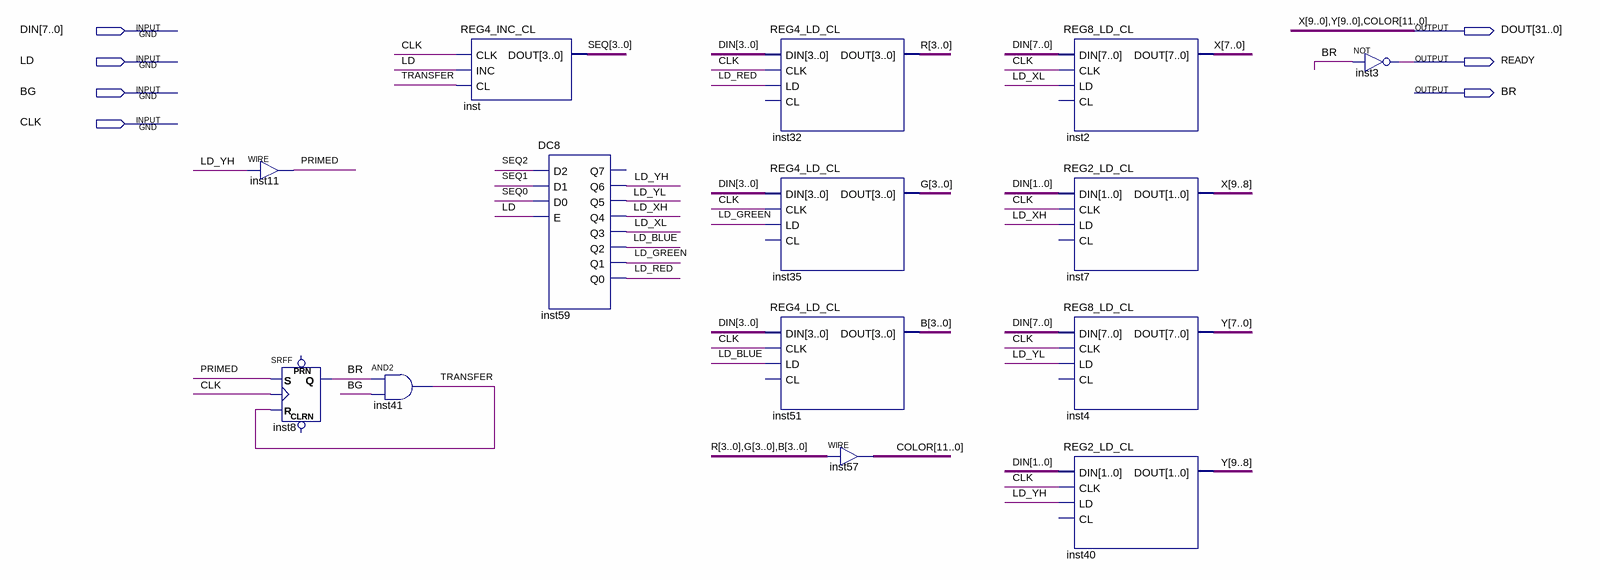
[diagram p0: schematic sheet]
// Quartus schematic render_pixel.bdf as structural Verilog: 14 symbols, 7 pins
module render_pixel (
  input  [7:0] DIN,
  input  LD,
  input  BG,
  input  CLK,
  output [31:0] DOUT,
  output READY,
  output BR
);

  wire LD_BLUE, LD_GREEN, LD_RED, LD_XH, LD_XL, LD_YH, LD_YL, PRIMED, TRANSFER;
  wire [3:0] B, G, R, SEQ;

  assign PRIMED = LD_YH;  // WIRE inst11
  SRFF inst8 (.S(PRIMED), .R(TRANSFER), .CLK(CLK), .Q(BR));  // open: PRN, CLRN
  and inst41 (TRANSFER, BR, BG);
  REG4_INC_CL inst (.CLK(CLK), .INC(LD), .CL(TRANSFER), .DOUT(SEQ));
  DC8 inst59 (
    .D2(SEQ[2]), .D1(SEQ[1]), .D0(SEQ[0]), .E(LD), .Q6(LD_YH), .Q5(LD_YL), .Q4(LD_XH), .Q3(LD_XL),
    .Q2(LD_BLUE), .Q1(LD_GREEN), .Q0(LD_RED));  // open: Q7
  REG4_LD_CL inst32 (.DIN(DIN[3:0]), .CLK(CLK), .LD(LD_RED), .DOUT(R));  // open: CL
  REG4_LD_CL inst35 (.DIN(DIN[3:0]), .CLK(CLK), .LD(LD_GREEN), .DOUT(G));  // open: CL
  REG4_LD_CL inst51 (.DIN(DIN[3:0]), .CLK(CLK), .LD(LD_BLUE), .DOUT(B));  // open: CL
  assign DOUT[11:0] = {R, G, B};  // WIRE inst57
  REG8_LD_CL inst2 (.DIN(DIN), .CLK(CLK), .LD(LD_XL), .DOUT(DOUT[29:22]));  // open: CL
  REG2_LD_CL inst7 (.DIN(DIN[1:0]), .CLK(CLK), .LD(LD_XH), .DOUT(DOUT[31:30]));  // open: CL
  REG8_LD_CL inst4 (.DIN(DIN), .CLK(CLK), .LD(LD_YL), .DOUT(DOUT[19:12]));  // open: CL
  REG2_LD_CL inst40 (.DIN(DIN[1:0]), .CLK(CLK), .LD(LD_YH), .DOUT(DOUT[21:20]));  // open: CL
  not inst3 (READY, BR);

  // Other names for the same wires on the sheet: COLOR[11:0] = DOUT[11:0]; X[9:0] = DOUT[31:22]; Y[9:0] = DOUT[21:12]
endmodule
